# EAGLE schematic semi cnc v0 (EAGLE 9.6.2)

## Sheet 1 of 2
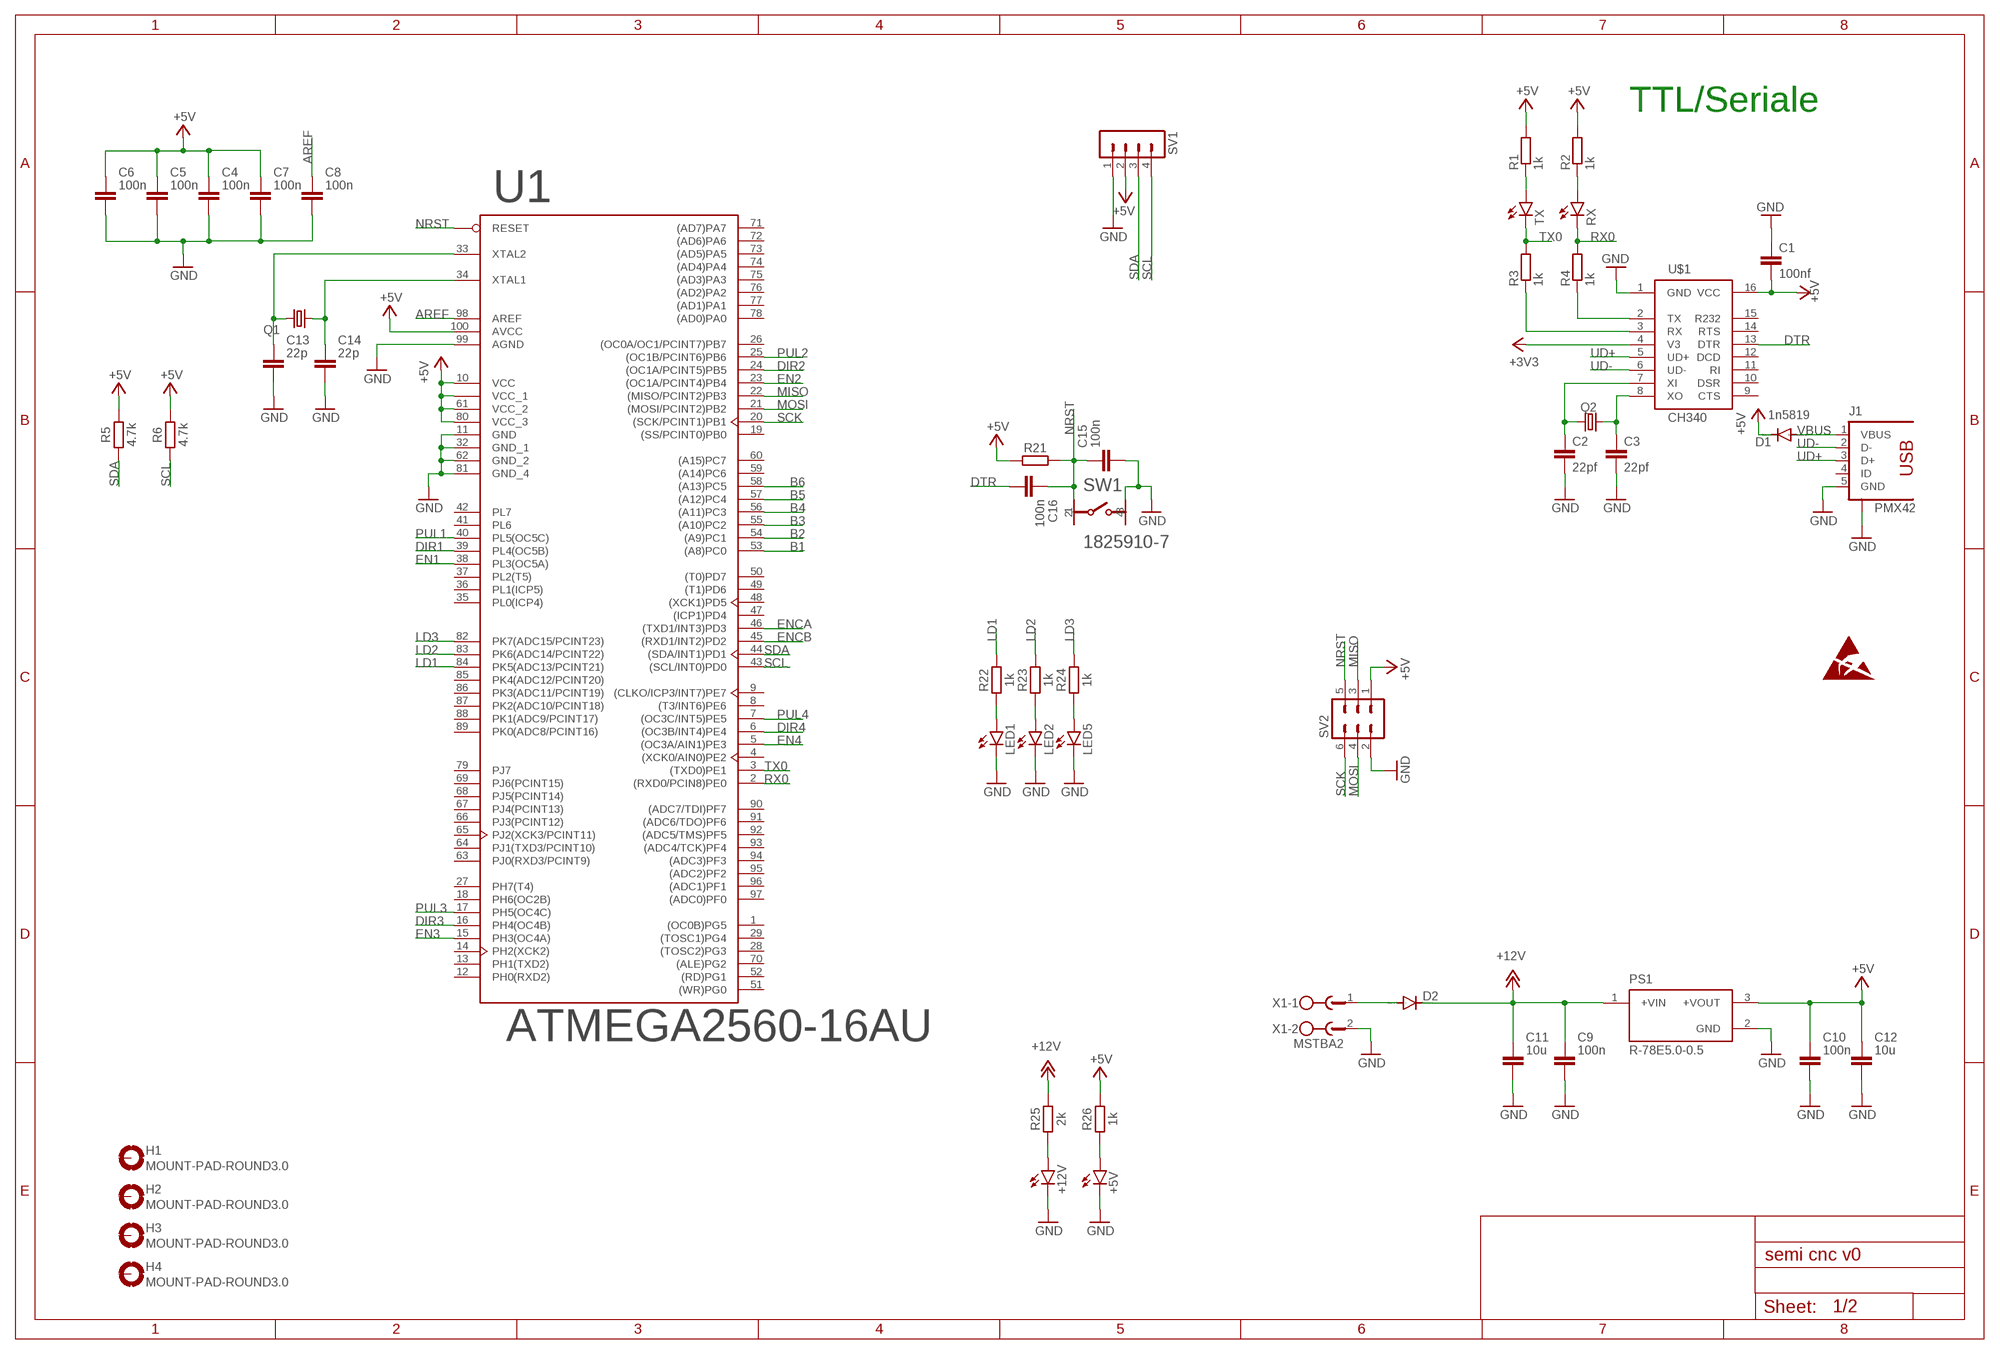
[diagram p0: schematic, sheet 1]

### Parts
+5V  LEDCHIP-LED0805  [CHIP-LED0805]
+12V  LEDCHIP-LED0805  [CHIP-LED0805]
C1  100nf  C-EUC0805  [C0805]
C2  22pf  C-EUC0603  [C0603]
C3  22pf  C-EUC0603  [C0603]
C4  100n  C_CHIP-0603(1608-METRIC)  [CAPC1608X85]
C5  100n  C_CHIP-0603(1608-METRIC)  [CAPC1608X85]
C6  100n  C_CHIP-0603(1608-METRIC)  [CAPC1608X85]
C7  100n  C_CHIP-0603(1608-METRIC)  [CAPC1608X85]
C8  100n  C_CHIP-0603(1608-METRIC)  [CAPC1608X85]
C9  100n  C_CHIP-0603(1608-METRIC)  [CAPC1608X85]
C10  100n  C_CHIP-0603(1608-METRIC)  [CAPC1608X85]
C11  10u  C_CHIP-0805(2012-METRIC)  [CAPC2012X110]
C12  10u  C_CHIP-0805(2012-METRIC)  [CAPC2012X110]
C13  22p  C_CHIP-0603(1608-METRIC)  [CAPC1608X85]
C14  22p  C_CHIP-0603(1608-METRIC)  [CAPC1608X85]
C15  100n  C_CHIP-0603(1608-METRIC)  [CAPC1608X85]
C16  100n  C_CHIP-0603(1608-METRIC)  [CAPC1608X85]
D1  1n5819  DIODE-SOD123  [SOD123]
D2  DIODE-SOD123  [SOD123]
H1  MOUNT-PAD-ROUND3.0  [3,0-PAD]
H2  MOUNT-PAD-ROUND3.0  [3,0-PAD]
H3  MOUNT-PAD-ROUND3.0  [3,0-PAD]
H4  MOUNT-PAD-ROUND3.0  [3,0-PAD]
J1  PMX42  PMX42_56579-0576  [PMX42_56579-0576]
LED1  LEDCHIP-LED0805  [CHIP-LED0805]
LED2  LEDCHIP-LED0805  [CHIP-LED0805]
LED5  LEDCHIP-LED0805  [CHIP-LED0805]
PS1  R-78E5.0-0.5  [CONV_R-78E5.0-0.5]
Q1  KX-7  [3.2X2.5_KX-7]
Q2  KX-7  [3.2X2.5_KX-7]
R1  1k  R-EU_R0805  [R0805]
R2  1k  R-EU_R0805  [R0805]
R3  1k  R-EU_R0805  [R0805]
R4  1k  R-EU_R0805  [R0805]
R5  4.7k  R_CHIP-0603(1608-METRIC)  [RESC1608X60]
R6  4.7k  R_CHIP-0603(1608-METRIC)  [RESC1608X60]
R21  R_CHIP-0603(1608-METRIC)  [RESC1608X60]
R22  1k  R_CHIP-0603(1608-METRIC)  [RESC1608X60]
R23  1k  R_CHIP-0603(1608-METRIC)  [RESC1608X60]
R24  1k  R_CHIP-0603(1608-METRIC)  [RESC1608X60]
R25  2k  R_CHIP-0603(1608-METRIC)  [RESC1608X60]
R26  1k  R_CHIP-0603(1608-METRIC)  [RESC1608X60]
RX  LEDSML0805  [SML0805]
SV1  MA04-1  [MA04-1]
SV2  MA03-2  [MA03-2]
SW1  TE_1825910-7TE_1825910-7_0_0  [TE_1825910-7_0]
TX  LEDSML0805  [SML0805]
U1  ATMEGA2560-16AU  [TQFP-100]
U$1  CH340  [SOIC16]
X1  MSTBA2  [MSTBA2]

### Nets
+3V3: U$1.4(V3)
+5V: C1.2 C4.1 C5.1 C6.1 C7.1 C10.1 C12.1 D1.C PS1.3(+VOUT) R1.2 R2.2 R5.2 R6.2 R21.1 R26.2 SV1.2 SV2.1 U1.10(VCC) U1.31(VCC_1) U1.61(VCC_2) U1.80(VCC_3) U1.100(AVCC) U$1.16(VCC) ; also sheet 2
+12V: C9.1 C11.1 D2.C PS1.1(+VIN) R25.2
AREF: C8.1 U1.98(AREF)
B1: U1.53((A8)PC0) ; also sheet 2
B2: U1.54((A9)PC1) ; also sheet 2
B3: U1.55((A10)PC2) ; also sheet 2
B4: U1.56((A11)PC3) ; also sheet 2
B5: U1.57((A12)PC4) ; also sheet 2
B6: U1.58((A13)PC5) ; also sheet 2
DIR1: U1.39(PL4(OC5B)) ; also sheet 2
DIR2: U1.24((OC1A/PCINT5)PB5) ; also sheet 2
DIR3: U1.16(PH4(OC4B)) ; also sheet 2
DIR4: U1.6((OC3B/INT4)PE4) ; also sheet 2
DTR: C16.2 U$1.13(DTR)
EN1: U1.38(PL3(OC5A)) ; also sheet 2
EN2: U1.23((OC1A/PCINT4)PB4) ; also sheet 2
EN3: U1.15(PH3(OC4A)) ; also sheet 2
EN4: U1.5((OC3A/AIN1)PE3) ; also sheet 2
ENCA: U1.46((TXD1/INT3)PD3) ; also sheet 2
ENCB: U1.45((RXD1/INT2)PD2) ; also sheet 2
GND: +5V.C +12V.C C1.1 C2.2 C3.2 C4.2 C5.2 C6.2 C7.2 C8.2 C9.2 C10.2 C11.2 C12.2 C13.2 C14.2 C15.2 J1.5(GND) LED1.C LED2.C LED5.C PS1.2(GND) SV1.1 SV2.2 SW1.3 U1.11(GND) U1.32(GND_1) U1.62(GND_2) U1.81(GND_4) U1.99(AGND) U$1.1(GND) X1.2 ; also sheet 2
LD1: R22.2 U1.84(PK5(ADC13/PCINT21))
LD2: R23.2 U1.83(PK6(ADC14/PCINT22))
LD3: R24.2 U1.82(PK7(ADC15/PCINT23))
MISO: SV2.3 U1.22((MISO/PCINT2)PB3)
MOSI: SV2.4 U1.21((MOSI/PCINT2)PB2)
N$1: J1.S1(S) J1.S2(S) J1.S3(S) J1.S4(S) ; supply symbol labelled GND
N$2: D2.A X1.1
N$8: C13.1 Q1.3 U1.33(XTAL2)
N$9: LED5.A R24.1
N$11: LED2.A R23.1
N$12: LED1.A R22.1
N$13: R4.1 U$1.2(TX)
N$14: R3.1 U$1.3(RX)
N$15: C3.1 Q2.1 U$1.8(XO)
N$16: C2.1 Q2.3 U$1.7(XI)
N$17: R2.1 RX.A
N$18: R1.1 TX.A
N$19: C14.1 Q1.1 U1.34(XTAL1)
N$20: +12V.A R25.1
N$21: +5V.A R26.1
NRST: C15.1 C16.1 R21.2 SV2.5 SW1.1 U1.30(RESET)
PUL1: U1.40(PL5(OC5C)) ; also sheet 2
PUL2: U1.25((OC1B/PCINT6)PB6) ; also sheet 2
PUL3: U1.17(PH5(OC4C)) ; also sheet 2
PUL4: U1.7((OC3C/INT5)PE5) ; also sheet 2
RX0: R4.2 RX.C U1.2((RXD0/PCIN8)PE0)
SCK: SV2.6 U1.20((SCK/PCINT1)PB1)
SCL: R6.1 SV1.4 U1.43((SCL/INT0)PD0)
SDA: R5.1 SV1.3 U1.44((SDA/INT1)PD1)
TX0: R3.2 TX.C U1.3((TXD0)PE1)
UD+: J1.3(D+) U$1.5(UD+)
UD-: J1.2(D-) U$1.6(UD-)
VBUS: D1.A J1.1(VBUS)
Unconnected: H1.B3,0(MOUNT) H2.B3,0(MOUNT) H3.B3,0(MOUNT) H4.B3,0(MOUNT) J1.4(ID) SW1.2 SW1.4 U1.1((OC0B)PG5) U1.4((XCK0/AIN0)PE2) U1.8((T3/INT6)PE6) U1.9((CLKO/ICP3/INT7)PE7) U1.12(PH0(RXD2)) U1.13(PH1(TXD2)) U1.14(PH2(XCK2)) U1.18(PH6(OC2B)) U1.19((SS/PCINT0)PB0) U1.26((OC0A/OC1/PCINT7)PB7) U1.27(PH7(T4)) U1.28((TOSC2)PG3) U1.29((TOSC1)PG4) U1.35(PL0(ICP4)) U1.36(PL1(ICP5)) U1.37(PL2(T5)) U1.41(PL6) U1.42(PL7) U1.47((ICP1)PD4) U1.48((XCK1)PD5) U1.49((T1)PD6) U1.50((T0)PD7) U1.51((WR)PG0) U1.52((RD)PG1) U1.59((A14)PC6) U1.60((A15)PC7) U1.63(PJ0(RXD3/PCINT9)) U1.64(PJ1(TXD3/PCINT10)) U1.65(PJ2(XCK3/PCINT11)) U1.66(PJ3(PCINT12)) U1.67(PJ4(PCINT13)) U1.68(PJ5(PCINT14)) U1.69(PJ6(PCINT15)) U1.70((ALE)PG2) U1.71((AD7)PA7) U1.72((AD6)PA6) U1.73((AD5)PA5) U1.74((AD4)PA4) U1.75((AD3)PA3) U1.76((AD2)PA2) U1.77((AD1)PA1) U1.78((AD0)PA0) U1.79(PJ7) U1.85(PK4(ADC12/PCINT20)) U1.86(PK3(ADC11/PCINT19)) U1.87(PK2(ADC10/PCINT18)) U1.88(PK1(ADC9/PCINT17)) U1.89(PK0(ADC8/PCINT16)) U1.90((ADC7/TDI)PF7) U1.91((ADC6/TDO)PF6) U1.92((ADC5/TMS)PF5) U1.93((ADC4/TCK)PF4) U1.94((ADC3)PF3) U1.95((ADC2)PF2) U1.96((ADC1)PF1) U1.97((ADC0)PF0) U$1.9(CTS) U$1.10(DSR) U$1.11(RI) U$1.12(DCD) U$1.14(RTS) U$1.15(R232)

### Notes on the sheet
- TTL/Seriale

## Sheet 2 of 2
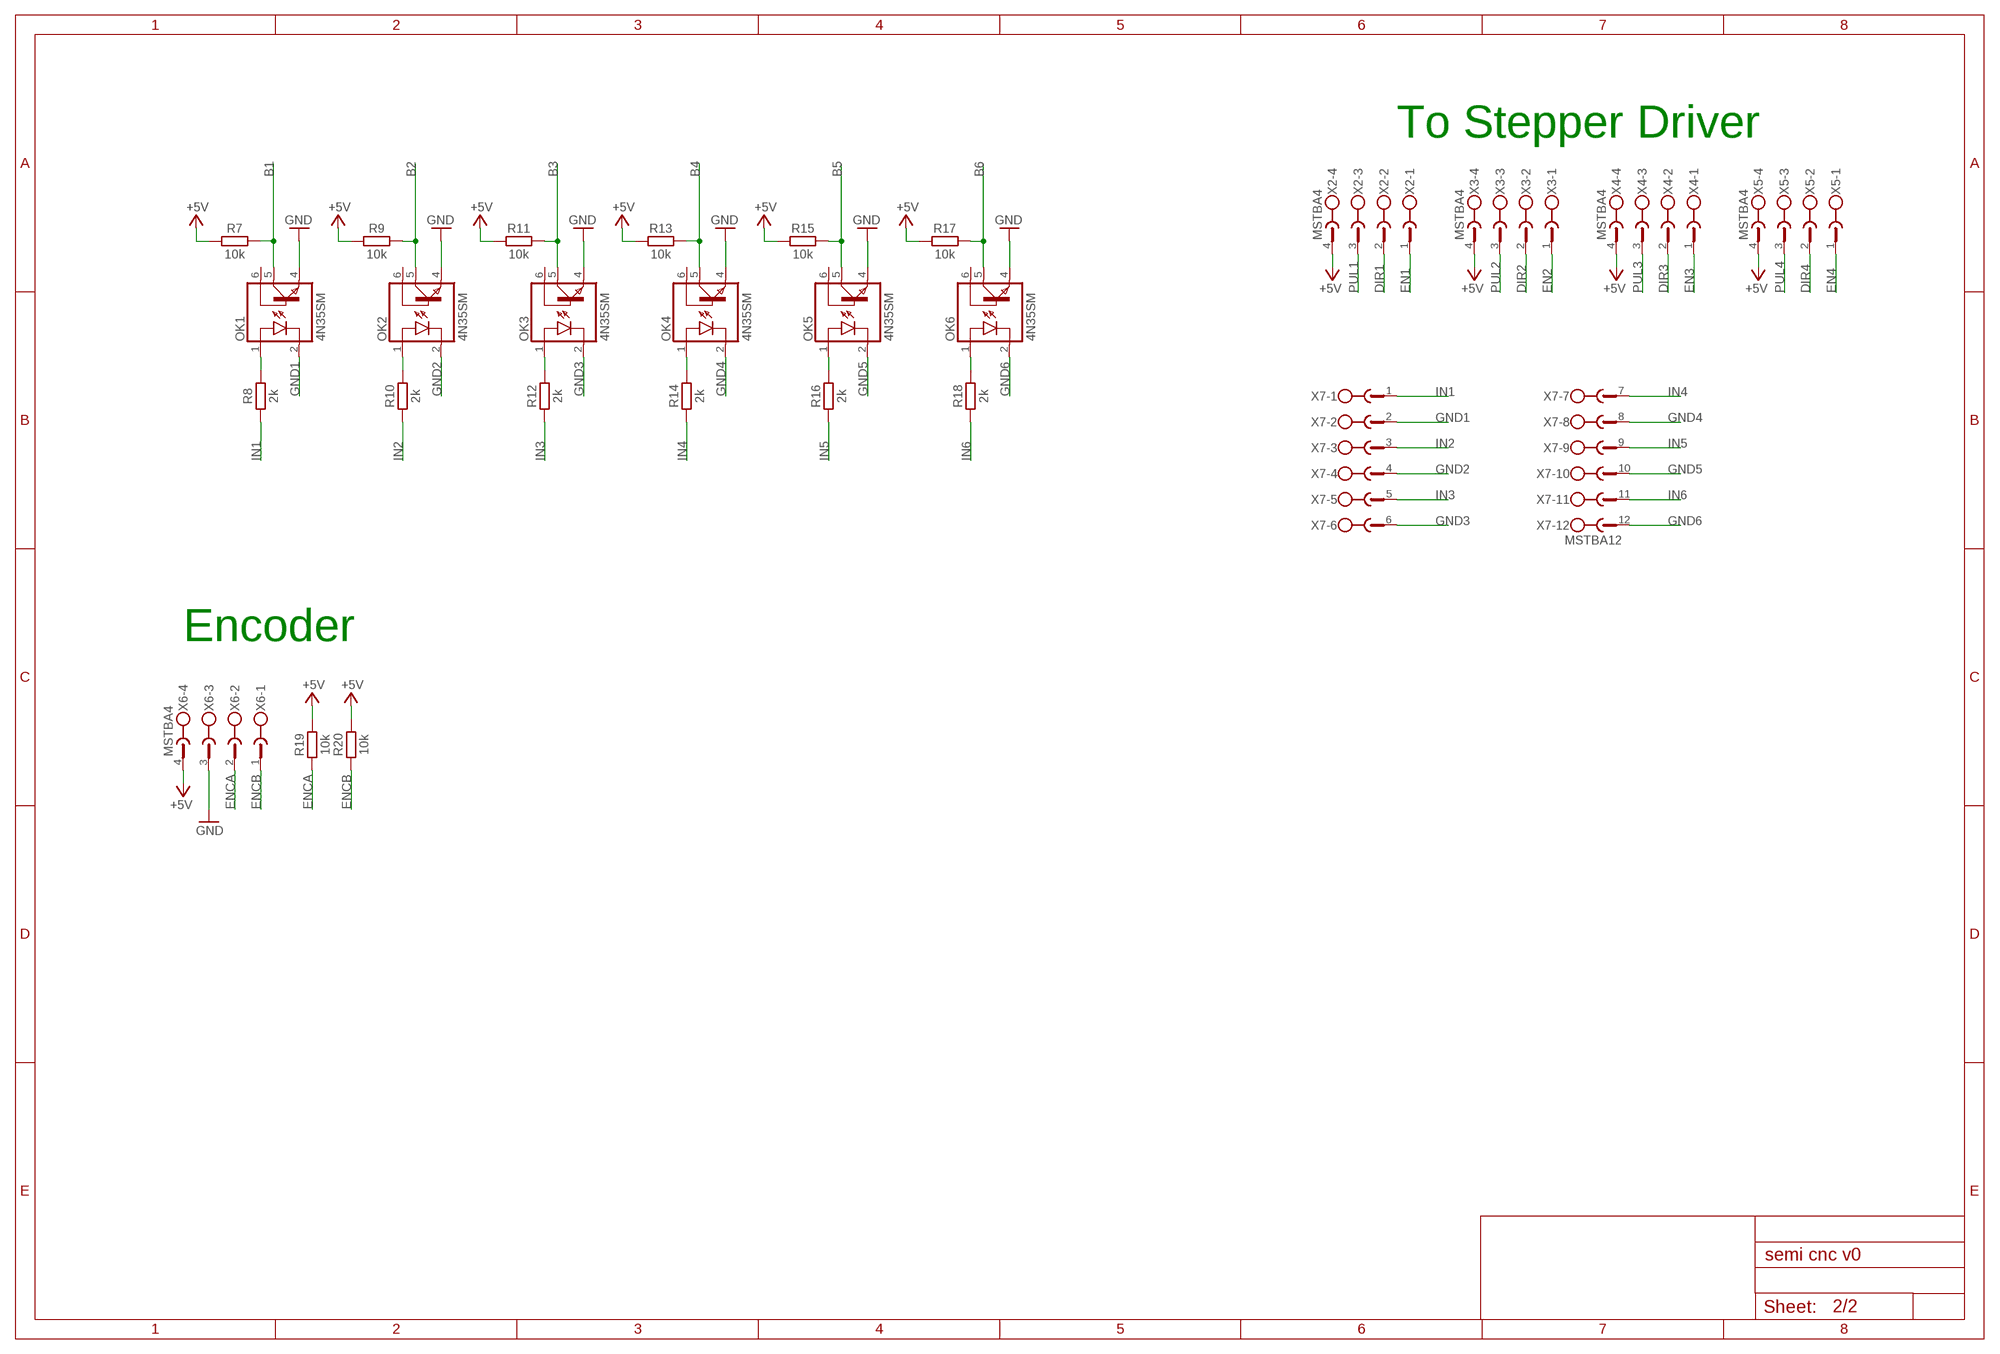
[diagram p1: schematic, sheet 2]

### Parts
OK1  4N35SM  [DIL6-SMD]
OK2  4N35SM  [DIL6-SMD]
OK3  4N35SM  [DIL6-SMD]
OK4  4N35SM  [DIL6-SMD]
OK5  4N35SM  [DIL6-SMD]
OK6  4N35SM  [DIL6-SMD]
R7  10k  R_CHIP-0603(1608-METRIC)  [RESC1608X60]
R8  2k  R_CHIP-0603(1608-METRIC)  [RESC1608X60]
R9  10k  R_CHIP-0603(1608-METRIC)  [RESC1608X60]
R10  2k  R_CHIP-0603(1608-METRIC)  [RESC1608X60]
R11  10k  R_CHIP-0603(1608-METRIC)  [RESC1608X60]
R12  2k  R_CHIP-0603(1608-METRIC)  [RESC1608X60]
R13  10k  R_CHIP-0603(1608-METRIC)  [RESC1608X60]
R14  2k  R_CHIP-0603(1608-METRIC)  [RESC1608X60]
R15  10k  R_CHIP-0603(1608-METRIC)  [RESC1608X60]
R16  2k  R_CHIP-0603(1608-METRIC)  [RESC1608X60]
R17  10k  R_CHIP-0603(1608-METRIC)  [RESC1608X60]
R18  2k  R_CHIP-0603(1608-METRIC)  [RESC1608X60]
R19  10k  R_CHIP-0603(1608-METRIC)  [RESC1608X60]
R20  10k  R_CHIP-0603(1608-METRIC)  [RESC1608X60]
X2  MSTBA4  [MSTBA4]
X3  MSTBA4  [MSTBA4]
X4  MSTBA4  [MSTBA4]
X5  MSTBA4  [MSTBA4]
X6  MSTBA4  [MSTBA4]
X7  MSTBA12  [MSTBA12]

### Nets
+5V: R7.1 R9.1 R11.1 R13.1 R15.1 R17.1 R19.2 R20.2 X2.4 X3.4 X4.4 X5.4 X6.4 ; also sheet 1
B1: OK1.5(COL) R7.2 ; also sheet 1
B2: OK2.5(COL) R9.2 ; also sheet 1
B3: OK3.5(COL) R11.2 ; also sheet 1
B4: OK4.5(COL) R13.2 ; also sheet 1
B5: OK5.5(COL) R15.2 ; also sheet 1
B6: OK6.5(COL) R17.2 ; also sheet 1
DIR1: X2.2 ; also sheet 1
DIR2: X3.2 ; also sheet 1
DIR3: X4.2 ; also sheet 1
DIR4: X5.2 ; also sheet 1
EN1: X2.1 ; also sheet 1
EN2: X3.1 ; also sheet 1
EN3: X4.1 ; also sheet 1
EN4: X5.1 ; also sheet 1
ENCA: R19.1 X6.2 ; also sheet 1
ENCB: R20.1 X6.1 ; also sheet 1
GND: OK1.4(EMI) OK2.4(EMI) OK3.4(EMI) OK4.4(EMI) OK5.4(EMI) OK6.4(EMI) X6.3 ; also sheet 1
GND1: OK1.2(C) X7.2
GND2: OK2.2(C) X7.4
GND3: OK3.2(C) X7.6
GND4: OK4.2(C) X7.8
GND5: OK5.2(C) X7.10
GND6: OK6.2(C) X7.12
IN1: R8.1 X7.1
IN2: R10.1 X7.3
IN3: R12.1 X7.5
IN4: R14.1 X7.7
IN5: R16.1 X7.9
IN6: R18.1 X7.11
N$3: OK4.1(A) R14.2
N$4: OK1.1(A) R8.2
N$5: OK5.1(A) R16.2
N$6: OK6.1(A) R18.2
N$7: OK2.1(A) R10.2
N$10: OK3.1(A) R12.2
PUL1: X2.3 ; also sheet 1
PUL2: X3.3 ; also sheet 1
PUL3: X4.3 ; also sheet 1
PUL4: X5.3 ; also sheet 1
Unconnected: OK1.6(BAS) OK2.6(BAS) OK3.6(BAS) OK4.6(BAS) OK5.6(BAS) OK6.6(BAS)

### Notes on the sheet
- To Stepper Driver
- Encoder

## Library data of the parts
+5V +12V LED1 LED2 LED5 RX TX = led:LED: LED OSRAM: - CHIPLED LG R971, LG N971, LY N971, LG Q971, LY Q971, LO R971, LY R971 LH N974, LH R974 LS Q976, LO Q976, LY Q976 LO Q996 - Hyper CHIPLED LW Q18S LB Q993, LB Q99A, LB R99A - SideLED LS A670, LO A670, LY A670, LG A670, LP A670 LB A673, LV A673, LT A673, LW A673 LH A674 LY A675 LS A676, LA A676, LO A676, LY A676, LW A676 LS A679, LY A679, LG A679 - Hyper Micro SIDELED® LS Y876, LA Y876, LO Y876, LY Y876 LT Y87S - SmartLED LW L88C, LW L88S LB L89C, LB L89S, LG L890 LS L89K, LO L89K, LY L89K LS L896, LA L896, LO L896, LY L896 - TOPLED LS T670, LO T670, LY T670, LG T670, LP T670 LSG T670, LSP T670, LSY T670, LOP T670, LYG T670 LG T671, LOG T671, LSG T671 LB T673, LV T673, LT T673, LW T673 LH T674 LS T676, LA T676, LO T676, LY T676, LB T676, LH T676, LSB T676, LW T676 LB T67C, LV T67C, LT T67C, LS T67K, LO T67K, LY T67K, LW E67C LS E67B, LA E67B, LO E67B, LY E67B, LB E67C, LV E67C, LT E67C LW T67C LS T679, LY T679, LG T679 LS T770, LO T770, LY T770, LG T770, LP T770 LB T773, LV T773, LT T773, LW T773 LH T774 LS E675, LA E675, LY E675, LS T675 LS T776, LA T776, LO T776, LY T776, LB T776 LHGB T686 LT T68C, LB T68C - Hyper Mini TOPLED® LB M676 - Mini TOPLED Santana® LG M470 LS M47K, LO M47K, LY M47K Source: http://www.osram.convergy.de LUXEON: - LUMILED® LXK2-PW12-R00, LXK2-PW12-S00, LXK2-PW14-U00, LXK2-PW14-V00 LXK2-PM12-R00, LXK2-PM12-S00, LXK2-PM14-U00 LXK2-PE12-Q00, LXK2-PE12-R00, LXK2-PE12-S00, LXK2-PE14-T00, LXK2-PE14-U00 LXK2-PB12-K00, LXK2-PB12-L00, LXK2-PB12-M00, LXK2-PB14-N00, LXK2-PB14-P00, LXK2-PB14-Q00 LXK2-PR12-L00, LXK2-PR12-M00, LXK2-PR14-Q00, LXK2-PR14-R00 LXK2-PD12-Q00, LXK2-PD12-R00, LXK2-PD12-S00 LXK2-PH12-R00, LXK2-PH12-S00 LXK2-PL12-P00, LXK2-PL12-Q00, LXK2-PL12-R00 Source: www.luxeon.com KINGBRIGHT: KA-3528ASYC Source: www.kingbright.com
C1-C3 = resistor:C-EU: CAPACITOR, European symbol
C4-C16 = Capacitor:C: Capacitor - Generic; CATEGORY: Capacitor
D1 D2 = diode:DIODE-: DIODE
H1-H4 = holes:MOUNT-PAD-ROUND: MOUNTING PAD, round
J1 = 52101-101-REV-A:PMX42_56579-0576: USB - OTG, miniUSB Type AB, Molex
OK1-OK6 = optocoupler:4N*?M: General Purpose 6-Pin Phototransistor Optocouplers Source: http://www.fairchildsemi.com/ds/4N/4N35-M.pdf; MF: FAIRCHILD SEMICONDUCTOR; MPN: 4N35S-M; OC_FARNELL: 1021179; OC_NEWARK: 67K2285
PS1 = R-78E5.0-0.5:R-78E5.0-0.5: 0.5 Amp SIP3 Single Output; ARROW_ELECTRONICS-PURCHASE-URL: https://snapeda.com/shop?store=Arrow+Electronics&id=229067; AVAILABILITY: Unavailable; DESCRIPTION: Switching regulator module - DC/DC converter . Single Output. 7.0V to 28.0V input voltage range and 5 V output voltage range; DIGIKEY-PURCHASE-URL: https://snapeda.com/shop?store=DigiKey&id=229067; MF: Recom Power; MOUSER-PURCHASE-URL: https://snapeda.com/shop?store=Mouser&id=229067; MP: R-78E5.0-0.5; PACKAGE: SIP-3 Recom Power; PRICE: None
Q1 Q2 = crystal-geyer_V1_0:KX: Quartz Crystals (MHz) SMD: KX - Serie Model Size l/w/h [mm] Frequency Range Frequency Stability Temp. Range [°C] Load Capacitance AECQ 200 availabel Datasheet KX-4 KX-5 KX-6 KX-7 KX-9A KX-9B KX-12A KX-12B KX-13 KX-20 KX-K KX-KS 1.6/1.2/0.3 2.0/1.6/0.45 2.5/2.0/0.55 3.2/2.5/0.8 5.0/3.2/1.0 5.0/3.2/1.1 6.0/3.5/1.1 6.0/3.5/1.0 7.0/5.0 /1.3 11.6/5.5/1.6 12.3/4.5/4.2 12.3/4.5/3.2 24.0 ~ 80.0 MHz 16.0 ~ 80.0 MHz 12.0 ~ 80.0 MHz 8.0 ~ 60.0 MHz 7,68 ~ 300,0 MHz 8,0 ~ 50,0 MHz 8,0 ~ 150,0 MHz 8,0 ~ 50,0 MHz 6,0 ~ 160,0 MHz 3,579 ~ 25,0 MHz 3,579 ~ 70,0 MHz 3,579 ~ 70,0 MHz ±10 … ±50ppm ±10 … ±50ppm ±10 … ±50ppm ±10 … ±50ppm ±10 … ±50ppm ±10 … ±50ppm ±10 … ±50ppm ±10 … ±50ppm ±10 … ±50ppm ±50ppm ±10 … ±50ppm ±10 … ±50ppm (*) -40°C …+85°C (*) -40°C …+125°C (*) -40°C …+125°C (*) -40°C …+125°C (*) -40°C …+105°C (*) -40°C …+105°C (*) -40°C …+125°C (*) -40°C …+105°C (*) -40°C …+105°C (*) -40°C …+105°C (*) -40°C …+85°C (*) -40°C …+85°C 8, 8…16 8, 8…16 10, 8…16 12, 7…20 16, 10…20 16, 10…20 16, 10…20 16, 12…20 16, 12…20 16, 12…20 16, 12…30 16, 12…30 - yes yes yes - - - - - - - - KX-4.pdf <http://www.geyer-electronic.de/uploads/tx_userartikelfrequenz/GEYER-KX-4.pdf> KX-5.pdf <http://www.geyer-electronic.de/uploads/tx_userartikelfrequenz/GEYER-KX-5.pdf> KX-6.pdf <http://www.geyer-electronic.de/uploads/tx_userartikelfrequenz/GEYER-KX-6.pdf> KX-7.pdf <http://www.geyer-electronic.de/uploads/tx_userartikelfrequenz/GEYER-KX-7.pdf> KX-9A.pdf <http://www.geyer-electronic.de/uploads/tx_userartikelfrequenz/GEYER-KX-9A.pdf> KX-9B.pdf <http://www.geyer-electronic.de/uploads/tx_userartikelfrequenz/GEYER-KX-9B.pdf> KX-12A.pdf <http://www.geyer-electronic.de/uploads/tx_userartikelfrequenz/GEYER-KX-12A.pdf> KX-12B.pdf <http://www.geyer-electronic.de/uploads/tx_userartikelfrequenz/GEYER-KX-12B.pdf> KX-13.pdf <http://www.geyer-electronic.de/uploads/tx_userartikelfrequenz/GEYER-KX-13.pdf> KX-20.pdf <http://www.geyer-electronic.de/uploads/tx_userartikelfrequenz/GEYER-KX-20.pdf> KX-K.pdf <http://www.geyer-electronic.de/uploads/tx_userartikelfrequenz/GEYER-KX-K.pdf> KX-KS.pdf <http://www.geyer-electronic.de/uploads/tx_userartikelfrequenz/GEYER-KX-KS.pdf> <http://www.geyer-electronic.de/fileadmin/template/img/logo-geyer-electronic.png> Details see: http://www.geyer-electronic.de/Frequenz-Produkte.9.0.html Created 2016-06-07, Hans Locher 2016 (C) Geyer Quartz Technology KX4,KX5,KX6,KX7,KX9A,KX9B,KX12A,KX12B,KX13,KX20,KXK,KXKS;1612;2016;2520;3225;5032;6035;7050;11655;12345;1,6x1,2;2,0x1,6;2,5x2,0;3,2x2,5;5,0x3,2;6,0x3,5;7,0x5,0;11,6x5,5;12,3x4,5;12,3x4,5;1.6x1.2;2.0x1.6;2.5x2.0;3.2x2.5;5.0x3.2;6.0x3.5;7.0x5.0;11.6x5.5;12.3x4.5;12.3x4.5;
R1-R4 = resistor:R-EU_: RESISTOR, European symbol
R5-R26 = Resistor:R: Resistor Fixed - Generic; CATEGORY: Resistor; SUB-CATEGORY: Fixed
SV1 = con-lstb:MA04-1: PIN HEADER; OC_FARNELL: unknown; OC_NEWARK: unknown
SV2 = con-lstb:MA03-2: PIN HEADER; OC_FARNELL: unknown; OC_NEWARK: unknown
SW1 = TE - 1825910-7:TE_1825910-7: 6 MM TACT SWITCH, THRU-HOLE HIGH TEMP; ACTUATOR_HEIGHT_OFF_PCB,_VERTICAL: 5.00mm; ACTUATOR_MATERIAL: Polybutylene Terephthalate (PBT); ACTUATOR_ORIENTATION: Top Actuated; ACTUATOR_TYPE: Standard; CENTROID_NOT_SPECIFIED: No; CIRCUIT: SPST-NO; CONTACT_RATING_@_VOLTAGE: 0.05A @ 24VDC; DATASHEET: http://www.te.com/commerce/DocumentDelivery/DDEController?Action=srchrtrv&DocNm=1825910&DocType=Customer+Drawing&DocLang=English; DIGIKEY_DESCRIPTION: SWITCH Tactile Switch SPST-NO Top Actuated Through Hole; DIGIKEY_PART_NUMBER: 450-1804-ND; ILLUMINATION: Non-Illuminated; LEAD_FREE: yes; MECHANICAL_LIFE: 100,000 Cycles; MF: TE; MOUNTING_TYPE: Through Hole; MOUSER_PART_NUMBER: 506-FSM4JAH; MPN: 1825910-7; OPERATING_FORCE: 260gf; OUTLINE: 6.00mm x 6.00mm; PACKAGE: Through Hole; PREFIX: SW; ROHS: yes; SWITCH_FUNCTION: Off-Mom; SWITCH_TRAVEL: 0.25mm; TEMPERATURE_RANGE_HIGH: +85°C; TEMPERATURE_RANGE_LOW: -35°C; TERMINATION_STYLE: PC Pin
U1 = Microcontroller:ATMEGA2560-16AU: IC MCU 8BIT 256KB FLASH 100TQFP Manufacturer's datasheet <http://ww1.microchip.com/downloads/en/DeviceDoc/Atmel-2549-8-bit-AVR-Microcontroller-ATmega640-1280-1281-2560-2561_Summary.pdf>; CREATED_BY: PCBLayout.com; DIGIKEY_PART_NUMBER: ATMEGA2560-16AU-ND; MANUFACTURER: Microchip Technology; MPN: ATMEGA2560-16AU; PACKAGE: TQFP-100
U$1 = CH340:CH340; AVAILABILITY: Unavailable; DESCRIPTION: Circuit Breaker Magnetic 3Pole 40A 240VAC; MF: Eaton; MP: CH340; PACKAGE: None; PRICE: None
X1 = con-phoenix-508:MSTBA2: PHOENIX; MF: FARNELL; MPN: 1757242; OC_FARNELL: 3705171; OC_NEWARK: 71C4161
X2-X6 = con-phoenix-508:MSTBA4: PHOENIX; MF: FARNELL; MPN: 1757268; OC_FARNELL: 3705195; OC_NEWARK: 71C4163
X7 = con-phoenix-508:MSTBA12: PHOENIX; MPN: 1757349; OC_FARNELL: 3705250; OC_NEWARK: 71C4169